# Altium schematic sheet LMZ12001SimplifiedGeneric.SchDoc
size A4
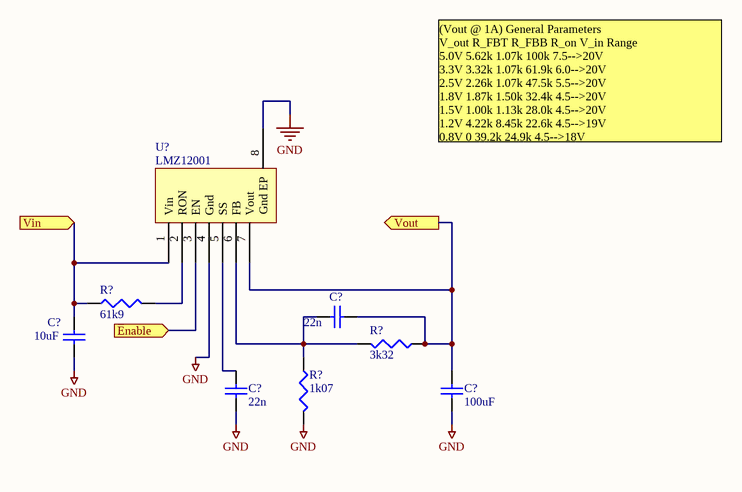
[diagram p0: LMZ12001SimplifiedGeneric.SchDoc]

## Parts
(Parts that share a designator on the sheet are numbered #1, #2 ... from top to bottom, then left to right.)
C?#1  22n  [0603]
C?#2  10uF  [1206]
C?#3  100uF  [1206]
C?#4  22n  [0603]
R?#1  61k9  [0603]
R?#2  3k32  [0603]
R?#3  1k07  [0603]
U?  LMZ12001  [LMZ12001]

## Ports
Enable (in), Vin (in), Vout (out)

## Nets
GND: C?#2.1 C?#3.2 C?#4.1 R?#3.2 U?.4(Gnd) U?.8(Gnd_EP)
Enable: U?.3(EN) ; port Enable
Vin: C?#2.2 R?#1.1 U?.1(Vin) ; port Vin
Vout: C?#1.1 C?#3.1 R?#2.1 U?.7(Vout) ; port Vout
NetC?#1_2: C?#1.2 R?#2.2 R?#3.1 U?.6(FB)
NetC?#4_2: C?#4.2 U?.5(SS)
NetR?#1_2: R?#1.2 U?.2(RON)

## Notes on the sheet
- (Vout @ 1A) General Parameters
  V_out	R_FBT	R_FBB	R_on	V_in Range
  5.0V	5.62k	1.07k	100k	7.5-->20V
  3.3V	3.32k	1.07k	61.9k	6.0-->20V
  2.5V	2.26k	1.07k	47.5k	5.5-->20V
  1.8V	1.87k	1.50k	32.4k	4.5-->20V
  1.5V	1.00k	1.13k	28.0k	4.5-->20V
  1.2V	4.22k	8.45k	22.6k	4.5-->19V
  0.8V	0	39.2k	24.9k	4.5-->18V

## Library data of the parts
C?#1-C?#4 = Cap: Capacitor; Published: 8-Jun-2000; LatestRevisionDate: 17-Jul-2002; LatestRevisionNote: Re-released for DXP Platform.; PackageReference: RAD-0.3; Publisher: Altium Limited; PackageDescription: Radial Cap, Thru-Hole; 2 Leads; 0.3 in Pin Spacing
  C?#2: Value: 10uF
  C?#3: Value: 100uF
R?#1 = RES1: R_on
R?#2 = RES1: 3.32k
R?#3 = RES1: 1.07k
U? = LMZ12001: Switching Regulator